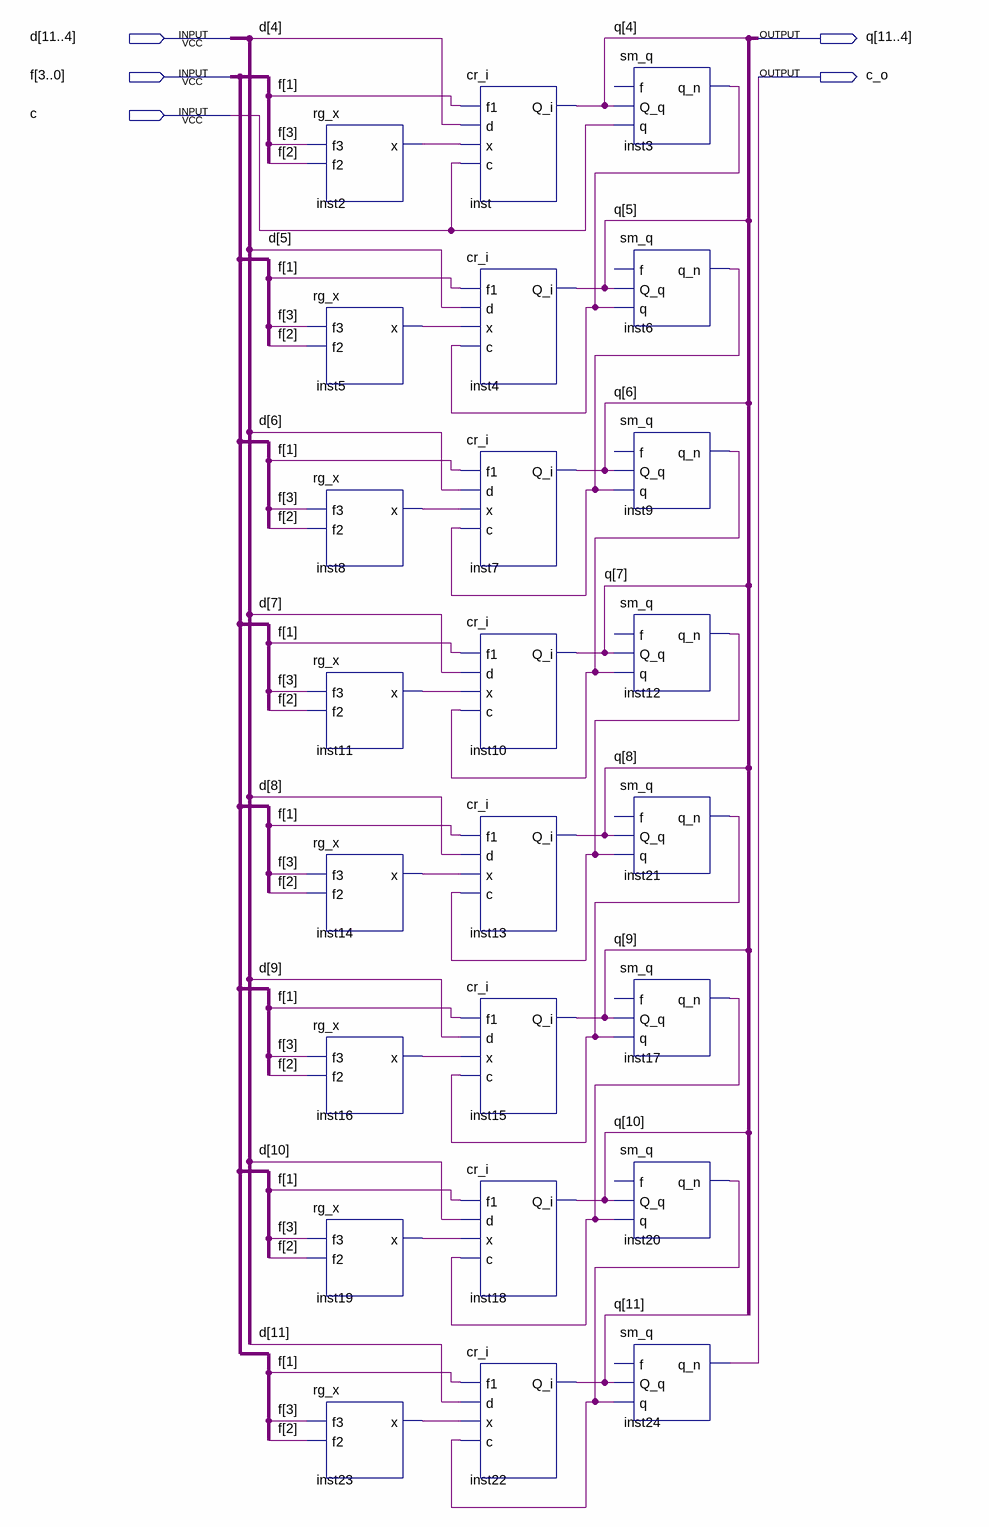
[diagram p0: schematic sheet]
// Quartus schematic cr.bdf as structural Verilog: 24 symbols, 5 pins
module cr (
  input  [11:4] d,
  input  [3:0] f,
  input  c,
  output [11:4] q,
  output c_o
);

  wire inst2_x, inst3_q_n, inst5_x, inst6_q_n, inst8_x, inst9_q_n, inst11_x, inst12_q_n, inst14_x, inst16_x,
       inst17_q_n, inst19_x, inst20_q_n, inst21_q_n, inst23_x;

  rg_x inst2 (.f3(f[3]), .f2(f[2]), .x(inst2_x));
  rg_x inst5 (.f3(f[3]), .f2(f[2]), .x(inst5_x));
  rg_x inst8 (.f3(f[3]), .f2(f[2]), .x(inst8_x));
  rg_x inst11 (.f3(f[3]), .f2(f[2]), .x(inst11_x));
  rg_x inst14 (.f3(f[3]), .f2(f[2]), .x(inst14_x));
  rg_x inst16 (.f3(f[3]), .f2(f[2]), .x(inst16_x));
  rg_x inst19 (.f3(f[3]), .f2(f[2]), .x(inst19_x));
  rg_x inst23 (.f3(f[3]), .f2(f[2]), .x(inst23_x));
  cr_i inst (.f1(f[1]), .d(d[4]), .x(inst2_x), .c(c), .Q_i(q[4]));
  cr_i inst4 (.f1(f[1]), .d(d[5]), .x(inst5_x), .c(inst3_q_n), .Q_i(q[5]));
  cr_i inst7 (.f1(f[1]), .d(d[6]), .x(inst8_x), .c(inst6_q_n), .Q_i(q[6]));
  cr_i inst10 (.f1(f[1]), .d(d[7]), .x(inst11_x), .c(inst9_q_n), .Q_i(q[7]));
  cr_i inst13 (.f1(f[1]), .d(d[8]), .x(inst14_x), .c(inst12_q_n), .Q_i(q[8]));
  cr_i inst15 (.f1(f[1]), .d(d[9]), .x(inst16_x), .c(inst21_q_n), .Q_i(q[9]));
  cr_i inst18 (.f1(f[1]), .d(d[10]), .x(inst19_x), .c(inst17_q_n), .Q_i(q[10]));
  cr_i inst22 (.f1(f[1]), .d(d[11]), .x(inst23_x), .c(inst20_q_n), .Q_i(q[11]));
  sm_q inst3 (.q(c), .Q_q(q[4]), .q_n(inst3_q_n));  // open: f
  sm_q inst6 (.q(inst3_q_n), .Q_q(q[5]), .q_n(inst6_q_n));  // open: f
  sm_q inst9 (.q(inst6_q_n), .Q_q(q[6]), .q_n(inst9_q_n));  // open: f
  sm_q inst12 (.q(inst9_q_n), .Q_q(q[7]), .q_n(inst12_q_n));  // open: f
  sm_q inst21 (.q(inst12_q_n), .Q_q(q[8]), .q_n(inst21_q_n));  // open: f
  sm_q inst17 (.q(inst21_q_n), .Q_q(q[9]), .q_n(inst17_q_n));  // open: f
  sm_q inst20 (.q(inst17_q_n), .Q_q(q[10]), .q_n(inst20_q_n));  // open: f
  sm_q inst24 (.q(inst20_q_n), .Q_q(q[11]), .q_n(c_o));  // open: f
endmodule
